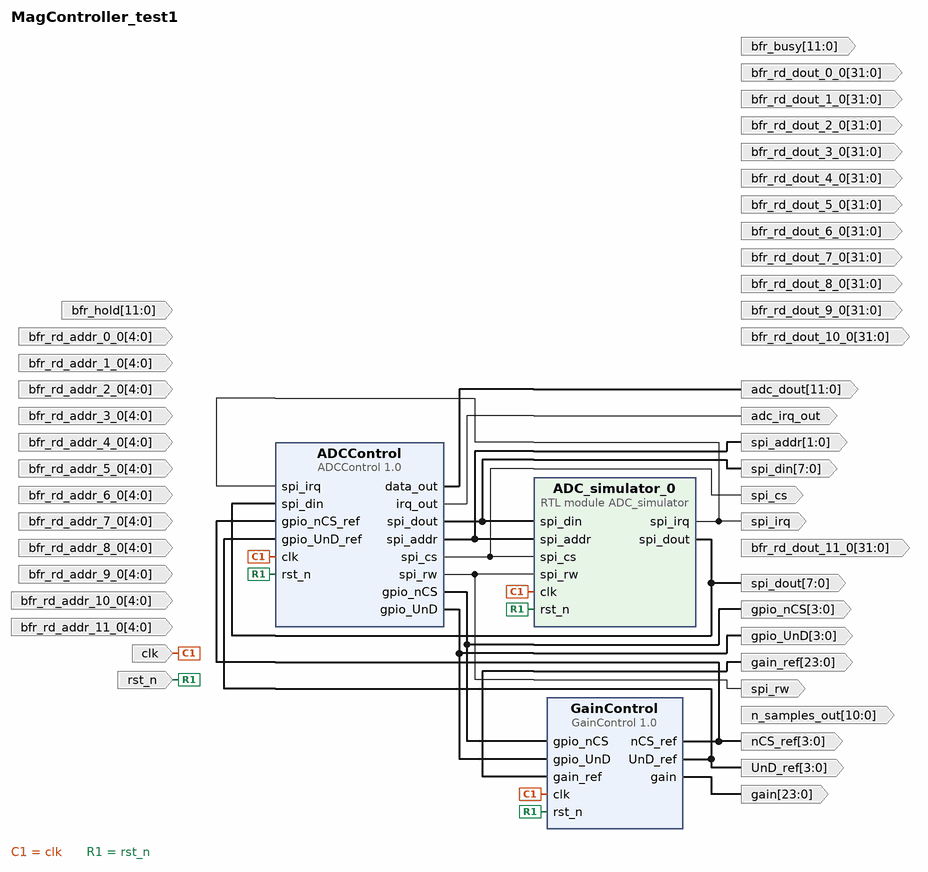
[diagram p0: block diagram of the top level]
# Vivado block design MagController_test1, xczu3eg-sbva484-1-i, Vivado 2020.2
create_bd_design MagController_test1

create_bd_port -dir I -type clk clk
create_bd_port -dir I -type rst rst_n
create_bd_port -dir O -from 7 -to 0 spi_din
create_bd_port -dir O -from 3 -to 0 nCS_ref
create_bd_port -dir O adc_irq_out
create_bd_port -dir O -from 11 -to 0 adc_dout
create_bd_port -dir O -from 3 -to 0 UnD_ref
create_bd_port -dir O -from 23 -to 0 gain
create_bd_port -dir O -from 3 -to 0 gpio_nCS
create_bd_port -dir O -from 1 -to 0 spi_addr
create_bd_port -dir O -from 3 -to 0 gpio_UnD
create_bd_port -dir O -from 7 -to 0 spi_dout
create_bd_port -dir O spi_cs
create_bd_port -dir O spi_rw
create_bd_port -dir O -from 23 -to 0 gain_ref
create_bd_port -dir O spi_irq
create_bd_port -dir O -from 11 -to 0 bfr_busy
create_bd_port -dir O -from 10 -to 0 n_samples_out
create_bd_port -dir I -from 11 -to 0 bfr_hold
create_bd_port -dir O -from 31 -to 0 bfr_rd_dout_10_0
create_bd_port -dir I -from 4 -to 0 bfr_rd_addr_2_0
create_bd_port -dir I -from 4 -to 0 bfr_rd_addr_10_0
create_bd_port -dir I -from 4 -to 0 bfr_rd_addr_11_0
create_bd_port -dir O -from 31 -to 0 bfr_rd_dout_1_0
create_bd_port -dir O -from 31 -to 0 bfr_rd_dout_2_0
create_bd_port -dir I -from 4 -to 0 bfr_rd_addr_4_0
create_bd_port -dir I -from 4 -to 0 bfr_rd_addr_1_0
create_bd_port -dir O -from 31 -to 0 bfr_rd_dout_6_0
create_bd_port -dir I -from 4 -to 0 bfr_rd_addr_3_0
create_bd_port -dir O -from 31 -to 0 bfr_rd_dout_11_0
create_bd_port -dir O -from 31 -to 0 bfr_rd_dout_4_0
create_bd_port -dir I -from 4 -to 0 bfr_rd_addr_6_0
create_bd_port -dir O -from 31 -to 0 bfr_rd_dout_5_0
create_bd_port -dir O -from 31 -to 0 bfr_rd_dout_8_0
create_bd_port -dir I -from 4 -to 0 bfr_rd_addr_5_0
create_bd_port -dir O -from 31 -to 0 bfr_rd_dout_3_0
create_bd_port -dir I -from 4 -to 0 bfr_rd_addr_8_0
create_bd_port -dir O -from 31 -to 0 bfr_rd_dout_7_0
create_bd_port -dir I -from 4 -to 0 bfr_rd_addr_7_0
create_bd_port -dir O -from 31 -to 0 bfr_rd_dout_0_0
create_bd_port -dir I -from 4 -to 0 bfr_rd_addr_0_0
create_bd_port -dir I -from 4 -to 0 bfr_rd_addr_9_0
create_bd_port -dir O -from 31 -to 0 bfr_rd_dout_9_0

create_bd_cell -type ip -vlnv DIII:PL-Mag-Sensor:GainControl:1.0 GainControl
create_bd_cell -type module -reference ADC_simulator ADC_simulator_0
create_bd_cell -type ip -vlnv DIII:PL-Mag-Sensor:ADCControl:1.0 ADCControl

# ---- connections ----

connect_bd_net -net clk_0_1 [get_bd_ports clk] [get_bd_pins GainControl/clk] [get_bd_pins ADC_simulator_0/clk] [get_bd_pins ADCControl/clk]
connect_bd_net -net rst_n_0_1 [get_bd_ports rst_n] [get_bd_pins GainControl/rst_n] [get_bd_pins ADC_simulator_0/rst_n] [get_bd_pins ADCControl/rst_n]
connect_bd_net [get_bd_pins ADC_simulator_0/spi_irq] [get_bd_ports spi_irq] [get_bd_pins ADCControl/spi_irq]
connect_bd_net [get_bd_pins ADCControl/spi_dout] [get_bd_ports spi_din] [get_bd_pins ADC_simulator_0/spi_din]
connect_bd_net [get_bd_pins GainControl/nCS_ref] [get_bd_ports nCS_ref] [get_bd_pins ADCControl/gpio_nCS_ref]
connect_bd_net [get_bd_pins ADCControl/irq_out] [get_bd_ports adc_irq_out]
connect_bd_net [get_bd_pins ADCControl/data_out] [get_bd_ports adc_dout]
connect_bd_net [get_bd_pins GainControl/UnD_ref] [get_bd_ports UnD_ref] [get_bd_pins ADCControl/gpio_UnD_ref]
connect_bd_net [get_bd_pins GainControl/gain] [get_bd_ports gain]
connect_bd_net [get_bd_pins ADCControl/gpio_nCS] [get_bd_ports gpio_nCS] [get_bd_pins GainControl/gpio_nCS]
connect_bd_net [get_bd_pins ADCControl/spi_addr] [get_bd_ports spi_addr] [get_bd_pins ADC_simulator_0/spi_addr]
connect_bd_net [get_bd_pins ADCControl/gpio_UnD] [get_bd_ports gpio_UnD] [get_bd_pins GainControl/gpio_UnD]
connect_bd_net [get_bd_pins ADC_simulator_0/spi_dout] [get_bd_ports spi_dout] [get_bd_pins ADCControl/spi_din]
connect_bd_net [get_bd_pins ADCControl/spi_cs] [get_bd_ports spi_cs] [get_bd_pins ADC_simulator_0/spi_cs]
connect_bd_net [get_bd_pins ADCControl/spi_rw] [get_bd_ports spi_rw] [get_bd_pins ADC_simulator_0/spi_rw]
connect_bd_net -net BufferFlowControlStr_0_gain_ref [get_bd_ports gain_ref] [get_bd_pins GainControl/gain_ref]

validate_bd_design
save_bd_design
